# Altium project modulo_control_prjpcb.PrjPcb
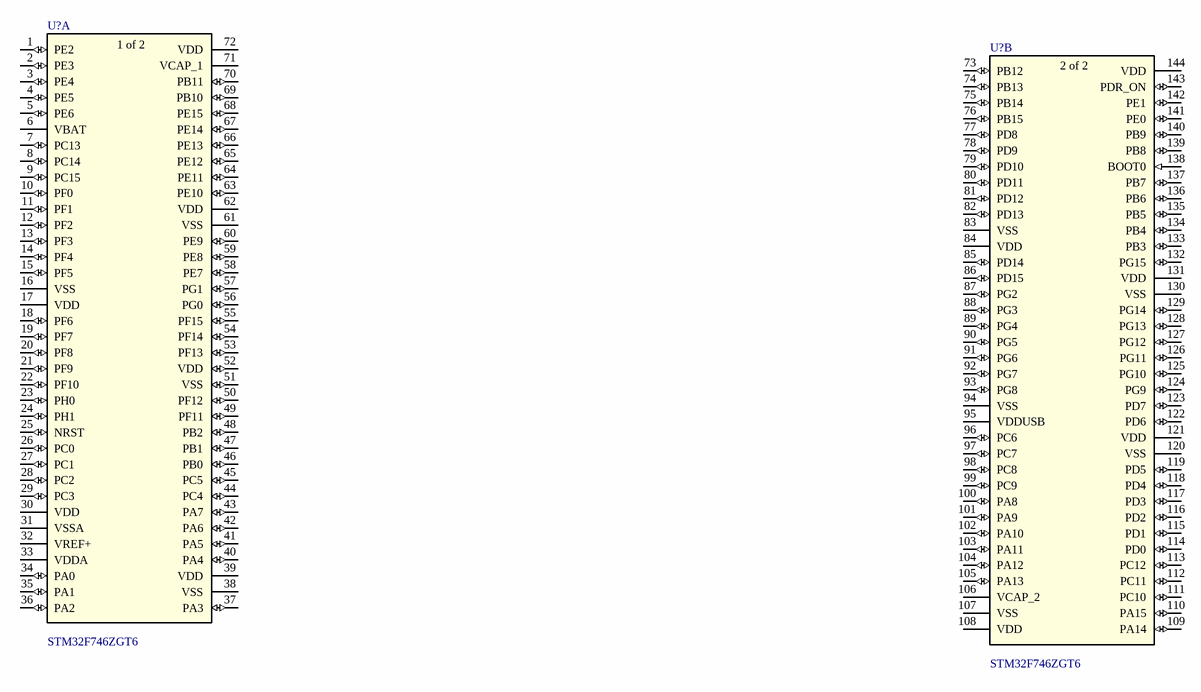
[diagram p0: modulo_control_schdoc.SchDoc]
Proyecto_localidad: Argentina, La Rioja, Capital (5300); Proyecto_integrantes: Diego Coll y Santiago Millicay; Proyecto: PRAXIS; Institución_localidad: Facultad Regional La Rioja; Institución_departamento: Departamento de Ing. Electrónica; Institución: UTN
1 sheet, 2 parts. Net scope: global (net labels, ports and power ports of the same name join across sheets).

## Sheet modulo_control_schdoc.SchDoc: Módulo de Control
size 393 x 281 mm; CheckedBy: Santiago Millicay; Author: Diego Coll; DocumentNumber: 1; Revision: 0.0.0; SheetNumber: 1; SheetTotal: 1; Organization: Altium Limited; Address1: L3, 12a Rodborough Rd; Address2: Frenchs Forest; Address3: NSW; Address4: Australia 2086; SheetFormat: A3

### Parts
(Parts that share a designator on the sheet are numbered #1, #2 ... from top to bottom, then left to right.)
U?#1  STM32F746ZGT6  [STM32F746ZGT6]  (part A of 2)
U?#2  STM32F746ZGT6  [STM32F746ZGT6]  (part B of 2)

### Nets

Not connected (* = marked no-connect by the designer): U?#1 1(PE2) 2(PE3) 3(PE4) 4(PE5) 5(PE6) 6(VBAT) 7(PC13) 8(PC14) 9(PC15) 10(PF0) 11(PF1) 12(PF2) 13(PF3) 14(PF4) 15(PF5) 16(VSS) 17(VDD) 18(PF6) 19(PF7) 20(PF8) 21(PF9) 22(PF10) 23(PH0) 24(PH1) 25(NRST) 26(PC0) 27(PC1) 28(PC2) 29(PC3) 30(VDD) 31(VSSA) 32(VREF+) 33(VDDA) 34(PA0) 35(PA1) 36(PA2) 37(PA3) 38(VSS) 39(VDD) 40(PA4) 41(PA5) 42(PA6) 43(PA7) 44(PC4) 45(PC5) 46(PB0) 47(PB1) 48(PB2) 49(PF11) 50(PF12) 51(VSS) 52(VDD) 53(PF13) 54(PF14) 55(PF15) 56(PG0) 57(PG1) 58(PE7) 59(PE8) 60(PE9) 61(VSS) 62(VDD) 63(PE10) 64(PE11) 65(PE12) 66(PE13) 67(PE14) 68(PE15) 69(PB10) 70(PB11) 71(VCAP_1) 72(VDD); U?#2 73(PB12) 74(PB13) 75(PB14) 76(PB15) 77(PD8) 78(PD9) 79(PD10) 80(PD11) 81(PD12) 82(PD13) 83(VSS) 84(VDD) 85(PD14) 86(PD15) 87(PG2) 88(PG3) 89(PG4) 90(PG5) 91(PG6) 92(PG7) 93(PG8) 94(VSS) 95(VDDUSB) 96(PC6) 97(PC7) 98(PC8) 99(PC9) 100(PA8) 101(PA9) 102(PA10) 103(PA11) 104(PA12) 105(PA13) 106(VCAP_2) 107(VSS) 108(VDD) 109(PA14) 110(PA15) 111(PC10) 112(PC11) 113(PC12) 114(PD0) 115(PD1) 116(PD2) 117(PD3) 118(PD4) 119(PD5) 120(VSS) 121(VDD) 122(PD6) 123(PD7) 124(PG9) 125(PG10) 126(PG11) 127(PG12) 128(PG13) 129(PG14) 130(VSS) 131(VDD) 132(PG15) 133(PB3) 134(PB4) 135(PB5) 136(PB6) 137(PB7) 138(BOOT0) 139(PB8) 140(PB9) 141(PE0) 142(PE1) 143(PDR_ON) 144(VDD)

### Notes on the sheet
- Título:
- Autor:
- Tamaño:
- Número:
- Fecha:
- Revisión:
- Hoja:
- Hora:
- de
- Revisado por:
- (in symbol STM32F746ZGT6, part A) 1 of 2
- (in symbol STM32F746ZGT6, part B) 2 of 2

### Library data of the parts
U?#1 U?#2 = STM32F746ZGT6: ARM Microcontrollers - MCU High-performance and DSP with FPU, ARM Cortex-M7 MCU with 1 Mbytes Flash, 200 MHz CPU, Art Accelerator, L1 cache, SDRAM; Manufacturer: STMicroelectronics; Peripherals: Brown-out Detect/Reset,POR,PWM,WDT,DMA,LCD; Frequency: 216MHz; Interface: I2C,SPI,USB,CAN,Ethernet,IrDA,SD,UART,USART,LIN,EBI/EMI; Number of I/Os: 114; Oscillator Type: Internal; RAM Size: 320KB; Min Supply Voltage: 1.7V; Max Supply Voltage: 3.6V; Memory Type: FLASH,OTP; Memory Size: 1MB; Data Bus Width: 32b; Number of USB Channels: 2; Number of ADC Channels: 24; Number of Timers/Counters: 15; Number of PWM Channels: 6; Data Rate: 480Mbps; Manufacturer Part Number: STM32F746ZGT6; RoHS: Yes; Category: Microcontrollers; Stock 1: 360; Pricing 1: 60=9,23015, 62=8,97375, 122=8,73122, 300=8,50146, 600=8,28347 (USD); Mount: Surface Mount; Case/Package: LQFP; Number of Pins: 144; Min Operating Temperature: -40°C; Max Operating Temperature: 85°C; Packaging: Tray; Max Frequency: 216MHz; Core Architecture: ARM; Length: 20.2mm; Height: 1.45mm; Width: 20.2mm; REACH SVHC: No SVHC; Lead Free: Lead Free; ComponentLink1URL: http://www.alliedelec.com/images/products/datasheets/bm/STMICROELECTRONICS/70612621.pdf?src-supplier=Allied+Electronics; ComponentLink1Description: http://www.alliedelec.com/images/products/datasheets/bm/STMICROELECTRONICS/70612621.pdf?src-supplier=Allied+Electronics; ComponentLink2URL: http://www.farnell.com/datasheets/2309059.pdf?src-supplier=Farnell; ComponentLink2Description: http://www.farnell.com/datasheets/2309059.pdf?src-supplier=Farnell; ComponentLink3URL: http://www.mouser.com/ds/2/389/stm32f745ie-956321.pdf?src-supplier=Mouser; ComponentLink3Description: http://www.mouser.com/ds/2/389/stm32f745ie-956321.pdf?src-supplier=Mouser; ComponentLink4URL: http://www.st.com/content/ccc/resource/technical/document/errata_sheet/4d/39/a6/8c/84/47/47/67/DM00145382.pdf/files/DM00145382.pdf/jcr:content/translations/en.DM00145382.pdf?src-supplier=Digi-Key; ComponentLink4Description: http://www.st.com/content/ccc/resource/technical/document/errata_sheet/4d/39/a6/8c/84/47/47/67/DM00145382.pdf/files/DM00145382.pdf/jcr:content/translations/en.DM00145382.pdf?src-supplier=Digi-Key; ComponentLink5URL: http://www.farnell.com/datasheets/2309059.pdf?src-supplier=Newark; ComponentLink5Description: http://www.farnell.com/datasheets/2309059.pdf?src-supplier=Newark; ComponentLink6URL: http://www.farnell.com/datasheets/2006547.pdf?src-supplier=Element14; ComponentLink6Description: http://www.farnell.com/datasheets/2006547.pdf?src-supplier=Element14; Supplier 1: Avnet; Supplier Part Number 1: STM32F746ZGT6